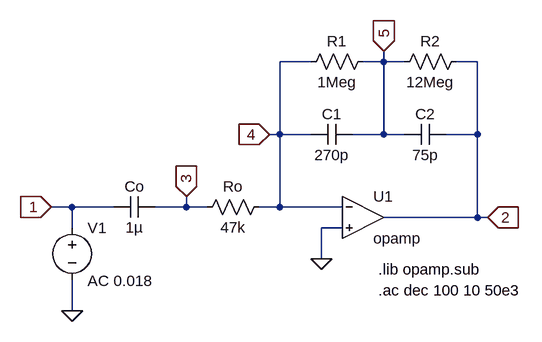
[diagram p0: schematic Simple Op Amp Phonograph Preamplifier.asc]
Simple Op Amp Phonograph Preamplifier.asc, the LTspice schematic file:
Version 4
SHEET 1 880 680
WIRE 288 -592 240 -592
WIRE 400 -592 400 -608
WIRE 400 -592 368 -592
WIRE 432 -592 400 -592
WIRE 544 -592 512 -592
WIRE 240 -480 240 -592
WIRE 240 -480 224 -480
WIRE 288 -480 240 -480
WIRE 400 -480 400 -592
WIRE 400 -480 352 -480
WIRE 432 -480 400 -480
WIRE 544 -480 544 -592
WIRE 544 -480 496 -480
WIRE -80 -368 -112 -368
WIRE -16 -368 -80 -368
WIRE 96 -368 96 -384
WIRE 96 -368 48 -368
WIRE 128 -368 96 -368
WIRE 240 -368 240 -480
WIRE 240 -368 208 -368
WIRE 336 -368 240 -368
WIRE 544 -352 544 -480
WIRE 544 -352 400 -352
WIRE 560 -352 544 -352
WIRE -80 -336 -80 -368
WIRE 336 -336 304 -336
WIRE 304 -288 304 -336
WIRE -80 -208 -80 -256
FLAG -80 -208 0
FLAG -112 -368 1
IOPIN -112 -368 In
FLAG 96 -384 3
IOPIN 96 -384 In
FLAG 400 -608 5
IOPIN 400 -608 In
FLAG 560 -352 2
IOPIN 560 -352 In
FLAG 304 -288 0
FLAG 224 -480 4
IOPIN 224 -480 In
SYMBOL res 384 -608 R90
WINDOW 0 0 56 VBottom 2
WINDOW 3 32 56 VTop 2
SYMATTR InstName R1
SYMATTR Value 1Meg
SYMBOL res 528 -608 R90
WINDOW 0 0 56 VBottom 2
WINDOW 3 32 56 VTop 2
SYMATTR InstName R2
SYMATTR Value 12Meg
SYMBOL cap 352 -496 R90
WINDOW 0 0 32 VBottom 2
WINDOW 3 32 32 VTop 2
SYMATTR InstName C1
SYMATTR Value 270p
SYMBOL cap 496 -496 R90
WINDOW 0 0 32 VBottom 2
WINDOW 3 32 32 VTop 2
SYMATTR InstName C2
SYMATTR Value 75p
SYMBOL OpAmps\\opamp 368 -416 R0
SYMATTR InstName U1
SYMBOL cap 48 -384 R90
WINDOW 0 0 32 VBottom 2
WINDOW 3 32 32 VTop 2
SYMATTR InstName Co
SYMATTR Value 1µ
SYMBOL res 224 -384 R90
WINDOW 0 0 56 VBottom 2
WINDOW 3 32 56 VTop 2
SYMATTR InstName Ro
SYMATTR Value 47k
SYMBOL voltage -80 -352 R0
WINDOW 123 24 98 Left 2
WINDOW 39 0 0 Left 0
SYMATTR Value2 AC 0.018
SYMATTR InstName V1
SYMATTR Value ""
TEXT 392 -272 Left 2 !.lib opamp.sub
TEXT 392 -240 Left 2 !.ac dec 100 10 50e3

The netlist it stands for:
* Simple Op Amp Phonograph Preamplifier.asc
R1 5 4 1Meg
R2 2 5 12Meg
C1 5 4 270p
C2 2 5 75p
XU1 4 0 2 opamp Aol=100K GBW=10Meg  ; pins invin noninvin out
Co 3 1 1µ
Ro 4 3 47k
V1 1 0 AC 0.018
.lib opamp.sub
.ac dec 100 10 50e3
.backanno
.end